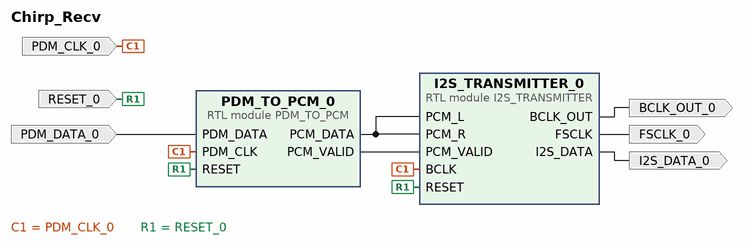
[diagram p0: block diagram of the top level]
# Vivado block design Chirp_Recv, xc7z020clg400-2, Vivado 2020.2
create_bd_design Chirp_Recv

create_bd_port -dir I -type clk PDM_CLK_0
create_bd_port -dir I PDM_DATA_0
create_bd_port -dir I -type rst RESET_0
create_bd_port -dir O I2S_DATA_0
create_bd_port -dir O FSCLK_0
create_bd_port -dir O BCLK_OUT_0

create_bd_cell -type module -reference I2S_TRANSMITTER I2S_TRANSMITTER_0
create_bd_cell -type module -reference PDM_TO_PCM PDM_TO_PCM_0

# ---- connections ----

connect_bd_net -net PDM_CLK_0_1 [get_bd_ports PDM_CLK_0] [get_bd_pins I2S_TRANSMITTER_0/BCLK] [get_bd_pins PDM_TO_PCM_0/PDM_CLK]
connect_bd_net -net PDM_DATA_0_1 [get_bd_ports PDM_DATA_0] [get_bd_pins PDM_TO_PCM_0/PDM_DATA]
connect_bd_net -net RESET_0_1 [get_bd_ports RESET_0] [get_bd_pins I2S_TRANSMITTER_0/RESET] [get_bd_pins PDM_TO_PCM_0/RESET]
connect_bd_net [get_bd_pins PDM_TO_PCM_0/PCM_DATA] [get_bd_pins I2S_TRANSMITTER_0/PCM_L] [get_bd_pins I2S_TRANSMITTER_0/PCM_R]
connect_bd_net [get_bd_pins PDM_TO_PCM_0/PCM_VALID] [get_bd_pins I2S_TRANSMITTER_0/PCM_VALID]
connect_bd_net [get_bd_pins I2S_TRANSMITTER_0/I2S_DATA] [get_bd_ports I2S_DATA_0]
connect_bd_net [get_bd_pins I2S_TRANSMITTER_0/FSCLK] [get_bd_ports FSCLK_0]
connect_bd_net [get_bd_pins I2S_TRANSMITTER_0/BCLK_OUT] [get_bd_ports BCLK_OUT_0]

validate_bd_design
save_bd_design
